# EAGLE schematic TaSCUD ver02 (EAGLE 8.1.0)
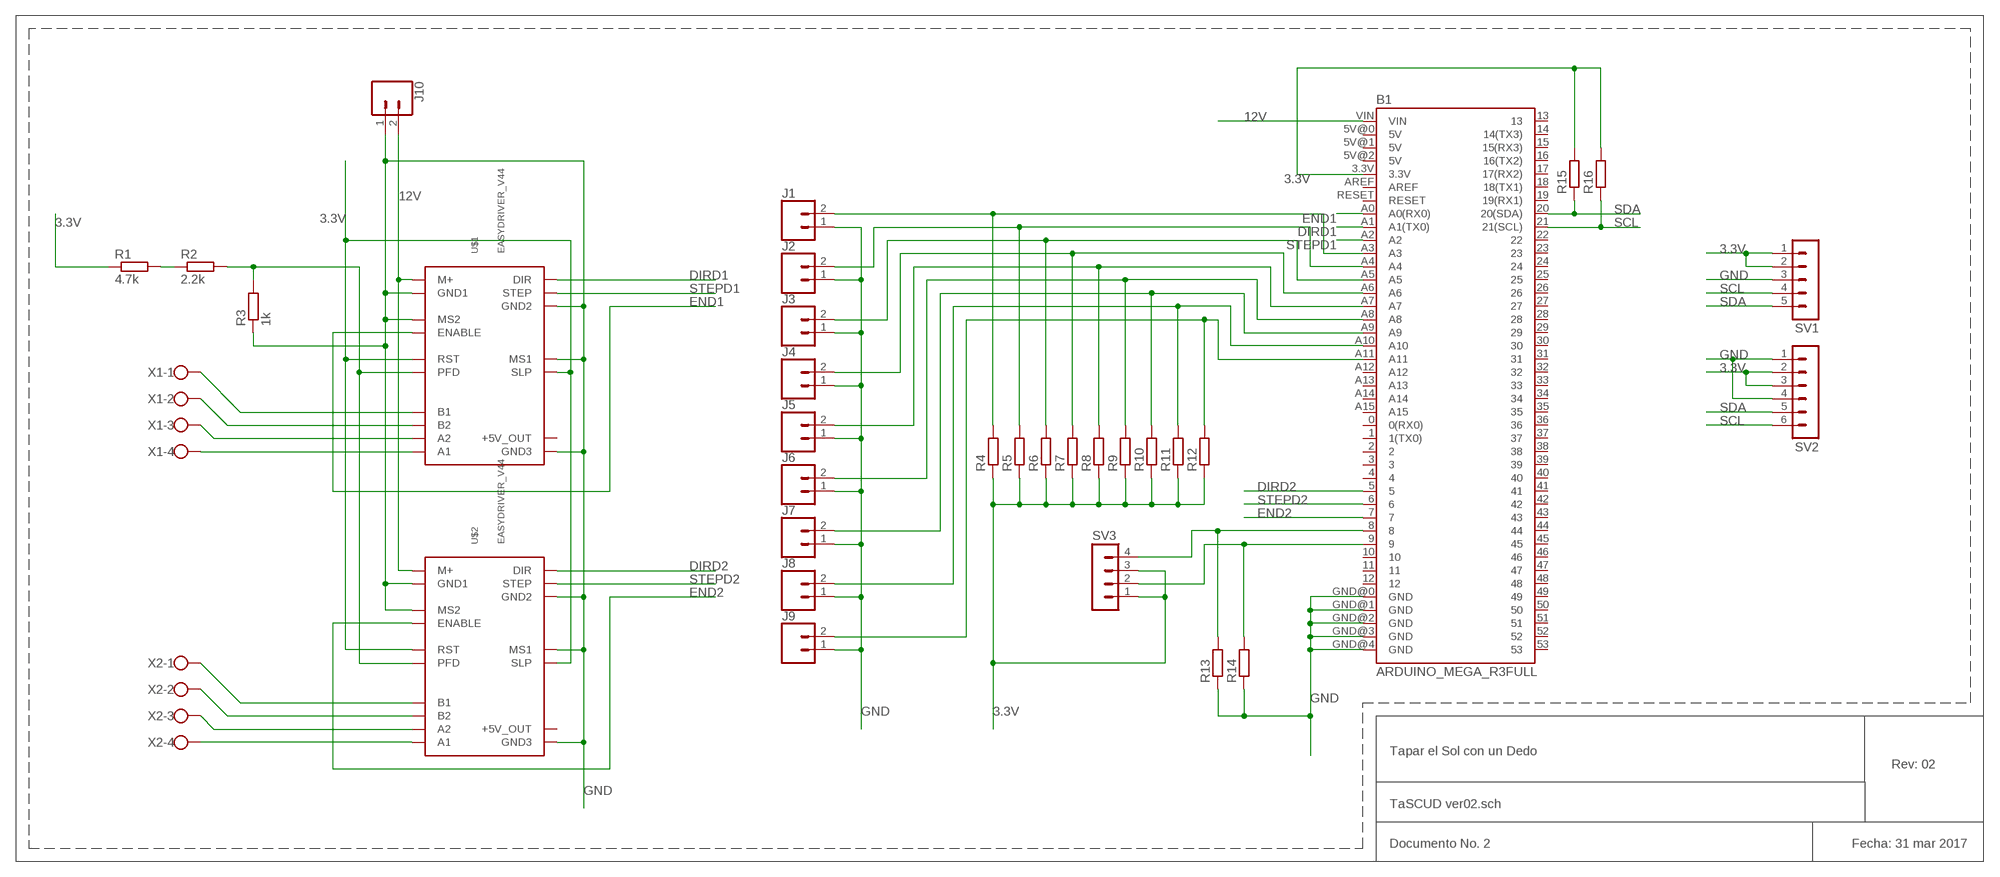
[diagram p0: schematic, sheet 1]

## Parts
B1  ARDUINO_MEGA_R3FULL  [ARDUINO_MEGA]
J1  CONN_023.5MM-NO_SILK  [SCREWTERMINAL-3.5MM-2-NS]
J2  CONN_023.5MM-NO_SILK  [SCREWTERMINAL-3.5MM-2-NS]
J3  CONN_023.5MM-NO_SILK  [SCREWTERMINAL-3.5MM-2-NS]
J4  CONN_023.5MM-NO_SILK  [SCREWTERMINAL-3.5MM-2-NS]
J5  CONN_023.5MM-NO_SILK  [SCREWTERMINAL-3.5MM-2-NS]
J6  CONN_023.5MM-NO_SILK  [SCREWTERMINAL-3.5MM-2-NS]
J7  CONN_023.5MM-NO_SILK  [SCREWTERMINAL-3.5MM-2-NS]
J8  CONN_023.5MM-NO_SILK  [SCREWTERMINAL-3.5MM-2-NS]
J9  CONN_023.5MM-NO_SILK  [SCREWTERMINAL-3.5MM-2-NS]
J10  CONN_023.5MM-NO_SILK  [SCREWTERMINAL-3.5MM-2-NS]
R1  4.7k  R-EU_0204/7  [0204/7]
R2  2.2k  R-EU_0204/7  [0204/7]
R3  1k  R-EU_0204/7  [0204/7]
R4  R-EU_0204/7  [0204/7]
R5  R-EU_0204/7  [0204/7]
R6  R-EU_0204/7  [0204/7]
R7  R-EU_0204/7  [0204/7]
R8  R-EU_0204/7  [0204/7]
R9  R-EU_0204/7  [0204/7]
R10  R-EU_0204/7  [0204/7]
R11  R-EU_0204/7  [0204/7]
R12  R-EU_0204/7  [0204/7]
R13  R-EU_0204/7  [0204/7]
R14  R-EU_0204/7  [0204/7]
R15  R-EU_0204/7  [0204/7]
R16  R-EU_0204/7  [0204/7]
SV1  MA05-1  [MA05-1]
SV2  MA06-1  [MA06-1]
SV3  MA04-1  [MA04-1]
U$1  EASYDRIVER_V44  [EASYDRIVER_V44]
U$2  EASYDRIVER_V44  [EASYDRIVER_V44]
X1  W237-4  [W237-4]
X2  W237-4  [W237-4]

## Nets
3.3V: B1.3.3V R1.1 R4.1 R5.1 R6.1 R7.1 R8.1 R9.1 R10.1 R11.1 R12.1 R15.2 R16.2 SV1.1 SV1.2 SV2.2 SV2.3 SV3.1 SV3.3 U$1.RST U$1.SLEEP(SLP) U$2.RST U$2.SLEEP(SLP)
12V: B1.VIN J10.2 U$1.M+ U$2.M+
DIRD1: B1.A1(A1(TX0)) U$1.DIR
DIRD2: B1.5 U$2.DIR
END1: B1.A0(A0(RX0)) U$1.ENABLE
END2: B1.7 U$2.ENABLE
GND: B1.GND@0(GND) B1.GND@1(GND) B1.GND@2(GND) B1.GND@3(GND) B1.GND@4(GND) J1.1 J2.1 J3.1 J4.1 J5.1 J6.1 J7.1 J8.1 J9.1 J10.1 R3.1 R13.1 R14.1 SV1.3 SV2.1 SV2.4 U$1.GND1 U$1.GND2 U$1.GND3 U$1.MS1 U$1.MS2 U$2.GND1 U$2.GND2 U$2.GND3 U$2.MS1 U$2.MS2
N$1: U$2.A1 X2.4
N$2: U$2.A2 X2.3
N$3: U$2.B2 X2.2
N$4: U$2.B1 X2.1
N$5: U$1.A1 X1.4
N$6: U$1.A2 X1.3
N$7: U$1.B2 X1.2
N$8: U$1.B1 X1.1
N$9: B1.A3 J1.2 R4.2
N$10: B1.8 R13.2 SV3.4
N$11: R1.2 R2.1
N$12: R2.2 R3.2 U$1.PFD U$2.PFD
N$13: B1.A4 J2.2 R5.2
N$14: B1.A5 J3.2 R6.2
N$15: B1.A6 J4.2 R7.2
N$16: B1.A7 J5.2 R8.2
N$17: B1.A8 J6.2 R9.2
N$18: B1.A9 J7.2 R10.2
N$19: B1.A10 J8.2 R11.2
N$20: B1.A11 J9.2 R12.2
N$21: B1.9 R14.2 SV3.2
SCL: B1.21(21(SCL)) R16.1 SV1.4 SV2.6
SDA: B1.20(20(SDA)) R15.1 SV1.5 SV2.5
STEPD1: B1.A2 U$1.STEP
STEPD2: B1.6 U$2.STEP
Unconnected: B1.0(0(RX0)) B1.1(1(TX0)) B1.2 B1.3 B1.4 B1.5V@0(5V) B1.5V@1(5V) B1.5V@2(5V) B1.10 B1.11 B1.12 B1.13 B1.14(14(TX3)) B1.15(15(RX3)) B1.16(16(TX2)) B1.17(17(RX2)) B1.18(18(TX1)) B1.19(19(RX1)) B1.22 B1.23 B1.24 B1.25 B1.26 B1.27 B1.28 B1.29 B1.30 B1.31 B1.32 B1.33 B1.34 B1.35 B1.36 B1.37 B1.38 B1.39 B1.40 B1.41 B1.42 B1.43 B1.44 B1.45 B1.46 B1.47 B1.48 B1.49 B1.50 B1.51 B1.52 B1.53 B1.A12 B1.A13 B1.A14 B1.A15 B1.AREF B1.RESET U$1.P$11(+5V_OUT) U$2.P$11(+5V_OUT)

## Notes on the sheet
- Tapar el Sol con un Dedo
- Rev: 02
- TaSCUD ver02.sch
- Documento No. 2 | Fecha: 31 mar 2017

## Library data of the parts
B1 = SparkFun-Boards:ARDUINO_MEGA_R3: Arduino Mega R3 ATmega2560 R3 compatible footprint. SparkFun Products: Arduino Mega 2560 R3 <https://www.sparkfun.com/products/11061>
J1-J10 = SparkFun-Connectors:CONN_02: Multi connection point. Often used as Generic Header-pin footprint for 0.1 inch spaced/style header connections On any of the 0.1 inch spaced packages, you can populate with these: Break Away Headers - Straight <https://www.sparkfun.com/products/116> (PRT-00116) Break Away Male Headers - Right Angle <https://www.sparkfun.com/products/553> (PRT-00553) Female Headers <https://www.sparkfun.com/products/115> (PRT-00115) Break Away Headers - Machine Pin <https://www.sparkfun.com/products/117> (PRT-00117) Break Away Female Headers - Swiss Machine Pin <https://www.sparkfun.com/products/743> (PRT-00743) For SCREWTERMINALS and SPRING TERMINALS visit here: Screw Terimnals on SparkFun.com <https://www.sparkfun.com/search/results?term=Screw+Terminals> (5mm/3.5mm/2.54mm spacing) This device is also useful as a general connection point to wire up your design to another part of your project. Our various solder wires solder well into these plated through hole pads. Hook-Up Wire - Assortment (Stranded, 22 AWG) <https://www.sparkfun.com/products/11375> (PRT-11375) Hook-Up Wire - Assortment (Solid Core, 22 AWG) <https://www.sparkfun.com/products/11367> (PRT-11367) View the entire wire category on our website here <https://www.sparkfun.com/categories/141> Special notes: Molex polarized connector foot print use with: PRT-08233 with associated crimp pins and housings. 2.54_SCREWTERM for use with PRT-10571. 3.5mm Screw Terminal footprints for PRT-08084 5mm Screw Terminal footprints for use with PRT-08432; PROD_ID: CONN-08399
R1-R16 = rcl:R-EU_: RESISTOR, European symbol
SV1 = con-lstb:MA05-1: PIN HEADER; OC_FARNELL: unknown; OC_NEWARK: unknown
SV2 = con-lstb:MA06-1: PIN HEADER; OC_FARNELL: unknown; OC_NEWARK: unknown
SV3 = con-lstb:MA04-1: PIN HEADER; OC_FARNELL: unknown; OC_NEWARK: unknown
U$1 U$2 = EasyDriver:EASYDRIVER_V44: EasyDriver version 4.4 - http://www.schmalzhaus.com/EasyDriver
X1 X2 = con-wago-500:W237-4: WAGO SCREW CLAMP; OC_FARNELL: unknown; OC_NEWARK: unknown